# EAGLE design SHIELDV2_NANO (EAGLE 9.6.2)
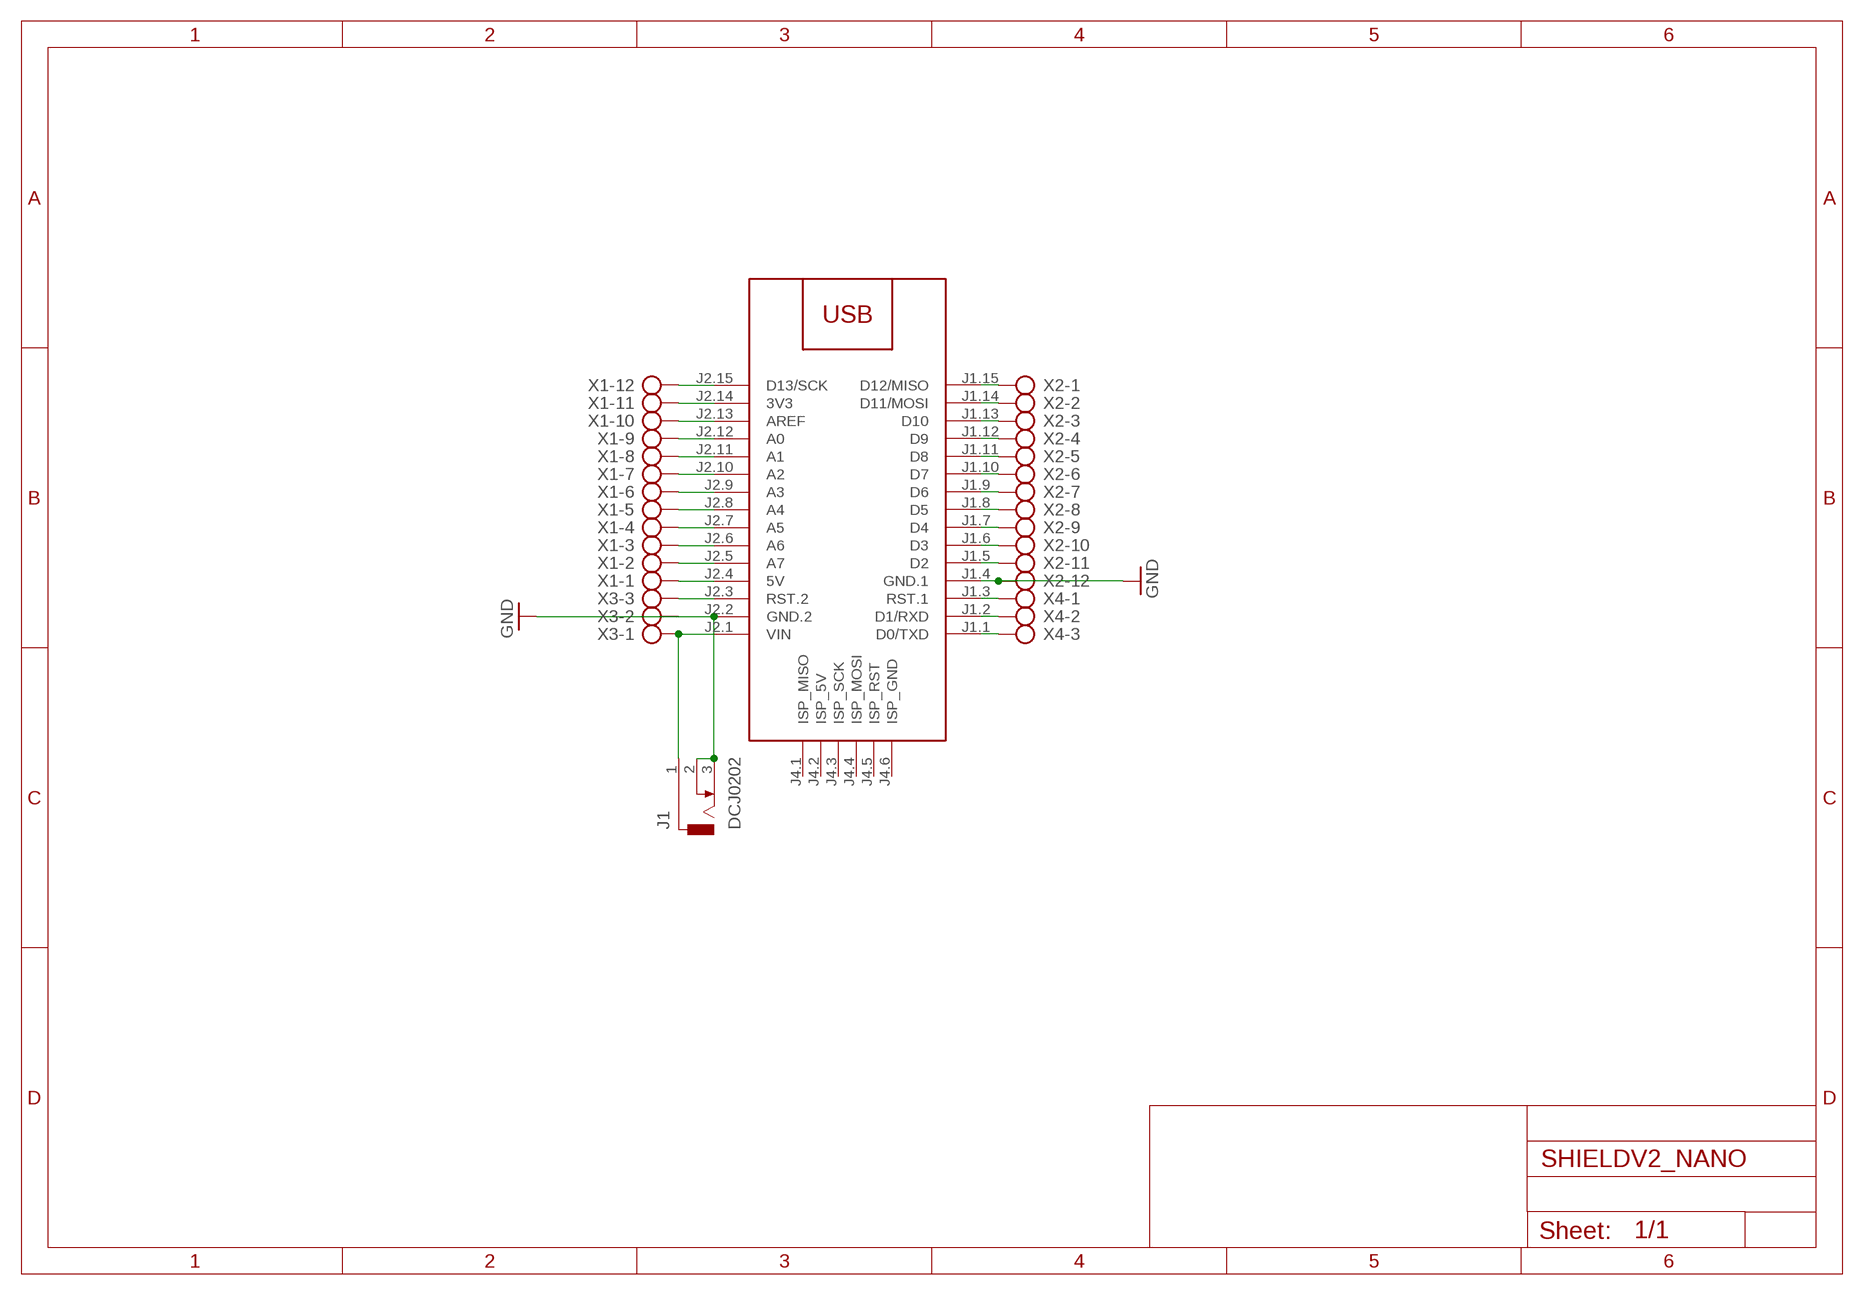
[diagram p0: schematic, sheet 1]

## Parts
J1  DCJ0202  [DCJ0202]
M1  ARDUINO-NANO-3.0#ISP  [ARDUINO-NANO-3.0#ISP]
X1  AK300/12  [AK300/12]
X2  AK300/12  [AK300/12]
X3  AK300/3  [AK300/3]
X4  AK300/3  [AK300/3]

## Nets
GND: J1.2 J1.3 M1.J1.4(GND.1) M1.J2.2(GND.2) X2.12 X3.2
N$1: M1.J1.3(RST.1) X4.1
N$2: J1.1 M1.J2.1(VIN) X3.1
N$3: M1.J2.15(D13/SCK) X1.12
N$4: M1.J2.14(3V3) X1.11
N$5: M1.J2.13(AREF) X1.10
N$6: M1.J2.12(A0) X1.9
N$7: M1.J2.11(A1) X1.8
N$8: M1.J2.10(A2) X1.7
N$9: M1.J2.9(A3) X1.6
N$10: M1.J2.8(A4) X1.5
N$11: M1.J2.7(A5) X1.4
N$12: M1.J2.6(A6) X1.3
N$13: M1.J2.5(A7) X1.2
N$14: M1.J2.4(5V) X1.1
N$15: M1.J1.15(D12/MISO) X2.1
N$16: M1.J1.14(D11/MOSI) X2.2
N$17: M1.J1.13(D10) X2.3
N$18: M1.J1.12(D9) X2.4
N$19: M1.J1.11(D8) X2.5
N$20: M1.J1.10(D7) X2.6
N$21: M1.J1.9(D6) X2.7
N$22: M1.J1.8(D5) X2.8
N$23: M1.J1.7(D4) X2.9
N$24: M1.J1.6(D3) X2.10
N$25: M1.J1.5(D2) X2.11
N$27: M1.J2.3(RST.2) X3.3
N$29: M1.J1.2(D1/RXD) X4.2
N$30: M1.J1.1(D0/TXD) X4.3
Unconnected: M1.J4.1(ISP_MISO) M1.J4.2(ISP_5V) M1.J4.3(ISP_SCK) M1.J4.4(ISP_MOSI) M1.J4.5(ISP_RST) M1.J4.6(ISP_GND)

## Library data of the parts
J1 = con-jack:DCJ0202: DC POWER JACK Source: DCJ0202.pdf; OC_FARNELL: unknown; OC_NEWARK: unknown
M1 = ARDUINO MODULOS:ARDUINO-NANO-3.0#ISP: Arduino Nano 3.0 with ISP pads
X1 X2 = con-ptr500:AK300/12: CONNECTOR; OC_FARNELL: unknown; OC_NEWARK: unknown
X3 X4 = con-ptr500:AK300/3: CONNECTOR; OC_FARNELL: unknown; OC_NEWARK: unknown

## Board
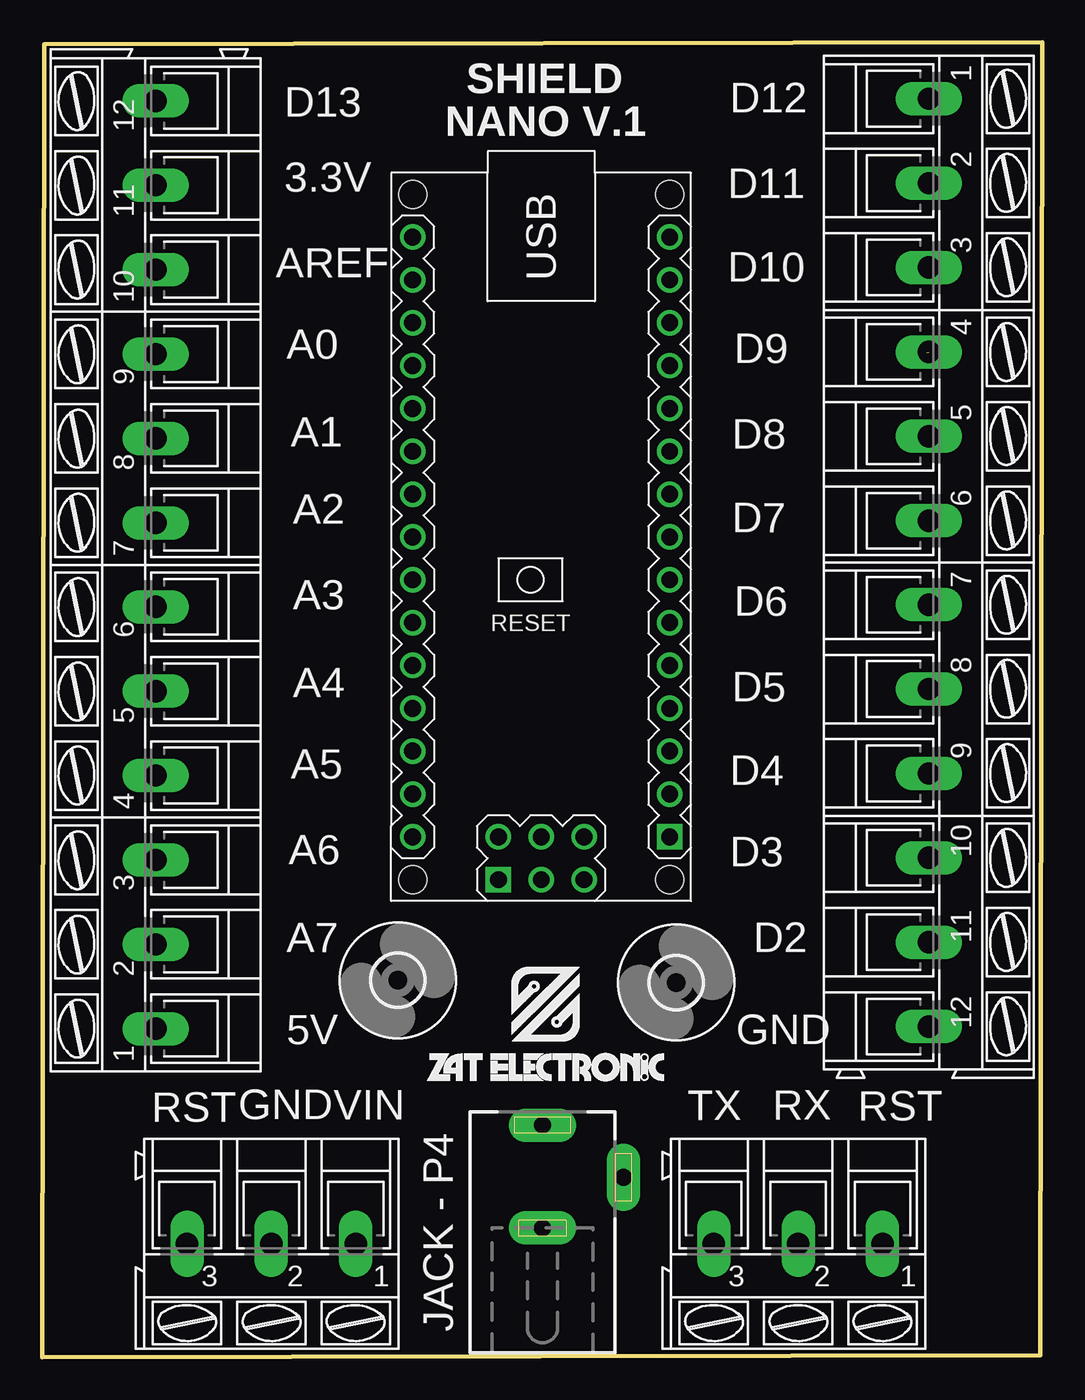
[diagram p1: board, top side]
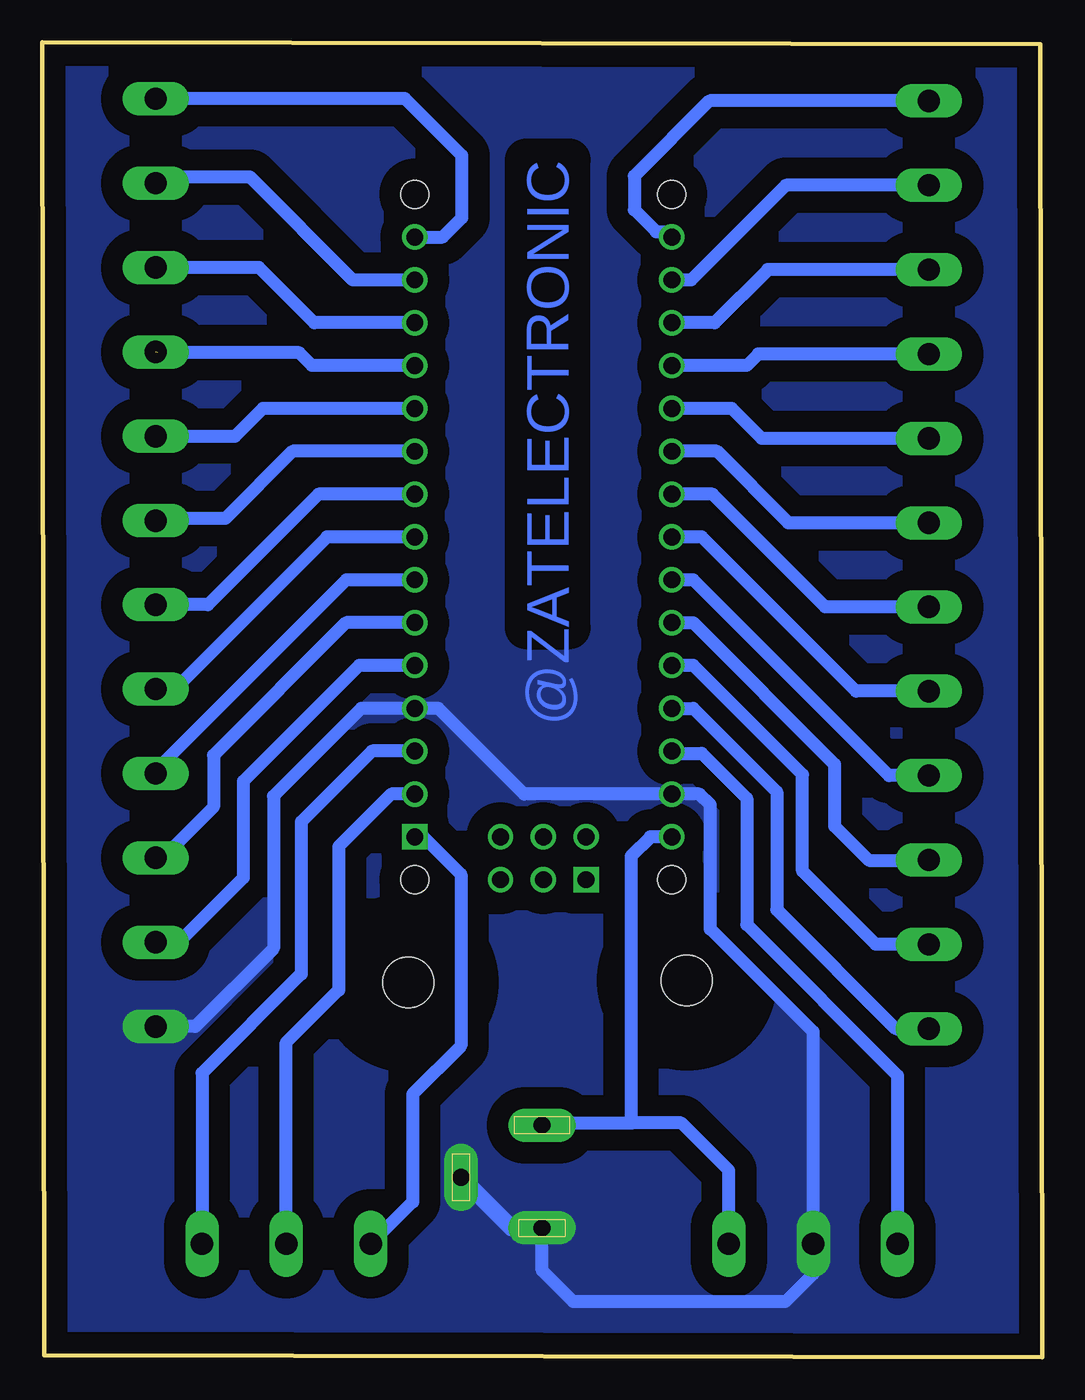
[diagram p2: board, bottom side, seen from below]

Size 59.31 x 77.98 mm. Coordinates in mm from the lower left corner, seen from the top.
Outline: 0.13,77.85 0,0 59.18,0.13 59.31,77.98 0.13,77.85
Copper layers (1*16): Top 0.035mm / dielectric 1.5mm / Bottom 0.035mm
Design rules "default *": minimum track width 30mil, minimum drill 0.35mm, track to track 6mil, track to pad 6mil, pad to pad 6mil, via to via 6mil, smd to smd 6mil, copper to edge 40mil, drill to drill 6mil, minimum pad ring 10mil, minimum via ring 8mil, stop-mask expansion 4mil, vias tented up to drill 0mil, thermal gap 10mil

### Footprints (pad centres in the part's own frame; a part is rotated, then mirrored left to right if it is on the bottom)
DCJ0202 = drill 1 pad 2 long: 1 0,3.1; 2 4.8,0; 3 0,-3
ARDUINO-NANO-3.0#ISP = drill 1 square: J1.1 17.78,7.62; J4.1 20.32,-2.54 | drill 1: J1.2 15.24,7.62; J1.3 12.7,7.62; J1.4 10.16,7.62; J1.5 7.62,7.62; J1.6 5.08,7.62; J1.7 2.54,7.62; J1.8 0,7.62; J1.9 -2.54,7.62; J1.10 -5.08,7.62; J1.11 -7.62,7.62; J1.12 -10.16,7.62; J1.13 -12.7,7.62; J1.14 -15.24,7.62; J1.15 -17.78,7.62; J2.1 17.78,-7.62; J2.2 15.24,-7.62; J2.3 12.7,-7.62; J2.4 10.16,-7.62; J2.5 7.62,-7.62; J2.6 5.08,-7.62; J2.7 2.54,-7.62; J2.8 0,-7.62; J2.9 -2.54,-7.62; J2.10 -5.08,-7.62; J2.11 -7.62,-7.62; J2.12 -10.16,-7.62; J2.13 -12.7,-7.62; J2.14 -15.24,-7.62; J2.15 -17.78,-7.62; J4.2 17.78,-2.54; J4.3 20.32,0; J4.4 17.78,0; J4.5 20.32,2.54; J4.6 17.78,2.54 | hole 1.651: -20.32,7.62; -20.32,-7.62; 20.32,-7.62; 20.32,7.62
3,0 = hole 3: 0,0
AK300/12 = drill 1.321 long: 1 -27.508,0; 2 -22.504,0; 3 -17.501,0; 4 -12.497,0; 5 -7.493,0; 6 -2.489,0; 7 2.489,0; 8 7.493,0; 9 12.497,0; 10 17.501,0; 11 22.504,0; 12 27.508,0
AK300/3 = drill 1.321 long: 1 -5.004,0; 2 0,0; 3 5.004,0

### Placement (x,y rotation side)
J1  29.67,10.67 0 top
M1  29.59,48.64 270 top
U$1  [ZAT_ESCRITA_0.5]  22.61,16.13 0 top
U$2  [3,0]  21.08,22.35 0 top
U$3  [3,0]  37.59,22.22 0 top
X1  6.73,46.99 90 top
X2  52.58,47.12 270 top
X3  13.59,6.73 180 top
X4  44.83,6.73 180 top

### Tracks (layer width: path | path; a pad name or v marks a point on that pad's centre or on a via)
GND
  Bottom 0.762: J1.3 29.67,5.16 27.81,3.3 15.24,3.3 13.59,4.95 X3.2 13.59,19.3 19.68,25.4 19.68,32.77 20.32,33.4 M1.J2.2 30.73,33.4 35.81,38.48 M1.J1.4 40.39,38.48 45.59,33.27 45.59,24.26 50.24,19.61 X2.12
  Bottom 1.016: J1.2 31.47,7.67 J1.3
  pour Bottom (isolate 1.27, no thermals): 0.38,77.98 59.06,77.98 59.06,0.38 0.38,0.38
N$1
  Bottom 0.762: M1.J1.3 39.75,35.94 43.94,31.75 43.94,22.73 49.84,16.84 X4.1
N$2
  Bottom 0.762: M1.J2.1 23.24,30.86 24.38,29.72 24.38,13.95 24.33,13.89 | 24.33,13.89 21.41,13.89 18.59,11.08 X3.1 | J1.1 29.54,13.89 24.33,13.89
N$3
  Bottom 0.762: X1.12 19.74,74.5 24.19,70.04 24.19,68.04 22.89,66.74 22.29,66.74 M1.J2.15
N$4
  Bottom 0.762: X1.11 15.21,69.49 20.83,63.88 M1.J2.14
N$5
  Bottom 0.762: X1.10 16.28,64.49 19.43,61.34 M1.J2.13
N$6
  Bottom 0.762: X1.9 16.84,59.49 17.53,58.8 M1.J2.12
N$7
  Bottom 0.762: X1.8 16.64,54.48 18.42,56.26 M1.J2.11
N$8
  Bottom 0.762: X1.7 15.06,49.48 19.3,53.72 M1.J2.10
N$9
  Bottom 0.762: X1.6 12.88,44.5 19.56,51.18 M1.J2.9
N$10
  Bottom 0.762: X1.5 11.05,39.5 20.19,48.64 M1.J2.8
N$11
  Bottom 0.762: X1.4 9.09,34.49 20.7,46.1 M1.J2.7
N$12
  Bottom 0.762: M1.J2.6 20.7,43.56 12.32,35.18 12.32,31.5 10.29,29.46 6.22,29.46 6.25,29.49 X1.3
N$13
  Bottom 0.762: X1.2 9.88,24.49 14.22,28.83 14.22,34.54 20.7,41.02 M1.J2.5
N$14
  Bottom 0.762: M1.J2.4 20.7,38.48 15.75,33.53 15.75,26.54 8.69,19.48 X1.1
N$15
  Bottom 0.762: M1.J1.15 35.56,66.42 34.42,67.56 34.42,71.25 37.8,74.62 X2.1
N$16
  Bottom 0.762: M1.J1.14 40.89,63.88 46.99,69.98 52.7,69.98 52.7,69.75 X2.2
N$17
  Bottom 0.762: M1.J1.13 43.18,61.34 46.46,64.62 X2.3
N$18  (1 unrouted)
  Bottom 0.762: M1.J1.12 43.31,58.8 44.07,59.56 52.45,59.56
N$19
  Bottom 0.762: M1.J1.11 46.23,56.26 47.88,54.61 X2.5
N$20
  Bottom 0.762: M1.J1.10 44.45,53.72 48.44,49.73 52.2,49.73 52.4,49.53 53.85,49.53 53.77,49.61 X2.6
N$21
  Bottom 0.762: M1.J1.9 42.93,51.18 49.48,44.63 X2.7
N$22
  Bottom 0.762: M1.J1.8 42.42,48.64 51.44,39.62 X2.8
N$23
  Bottom 0.762: M1.J1.7 41.28,46.1 52.2,35.18 52.2,34.62 X2.9
N$24
  Bottom 0.762: X2.10 52.17,29.62 49.15,32.64 49.15,35.69 41.28,43.56 M1.J1.6
N$25
  Bottom 0.762: M1.J1.5 40.51,41.02 47.37,34.16 47.37,28.45 51.21,24.61 X2.11
N$27
  Bottom 0.762: M1.J2.3 21.84,35.81 20.19,35.81 17.53,33.15 17.53,25.65 8.59,16.71 X3.3
N$29
  Bottom 0.762: M1.J1.2 38.61,33.4 41.72,30.29 41.72,21.78 44.83,18.67 X4.2
N$30
  Bottom 0.762: M1.J1.1 36.7,30.86 34.48,28.64 34.48,18.48 37.34,15.62 37.34,9.22 X4.3

### Text on the board
Bottom: @ZATELECTRONIC
tNames: SHIELD | D13 | D12 | NANO V.1 | 3.3V | D11 | AREF | D10 | A0 | D9 | A1 | D8 | A2 | D7 | A3 | D6 | A4 | D5 | A5 | D4 | A6 | D3 | A7 | D2 | 5V | GND | RST | GND | VIN | TX | RX | RST | JACK - P4